# Altium schematic sheet DDR3.SchDoc
size A2
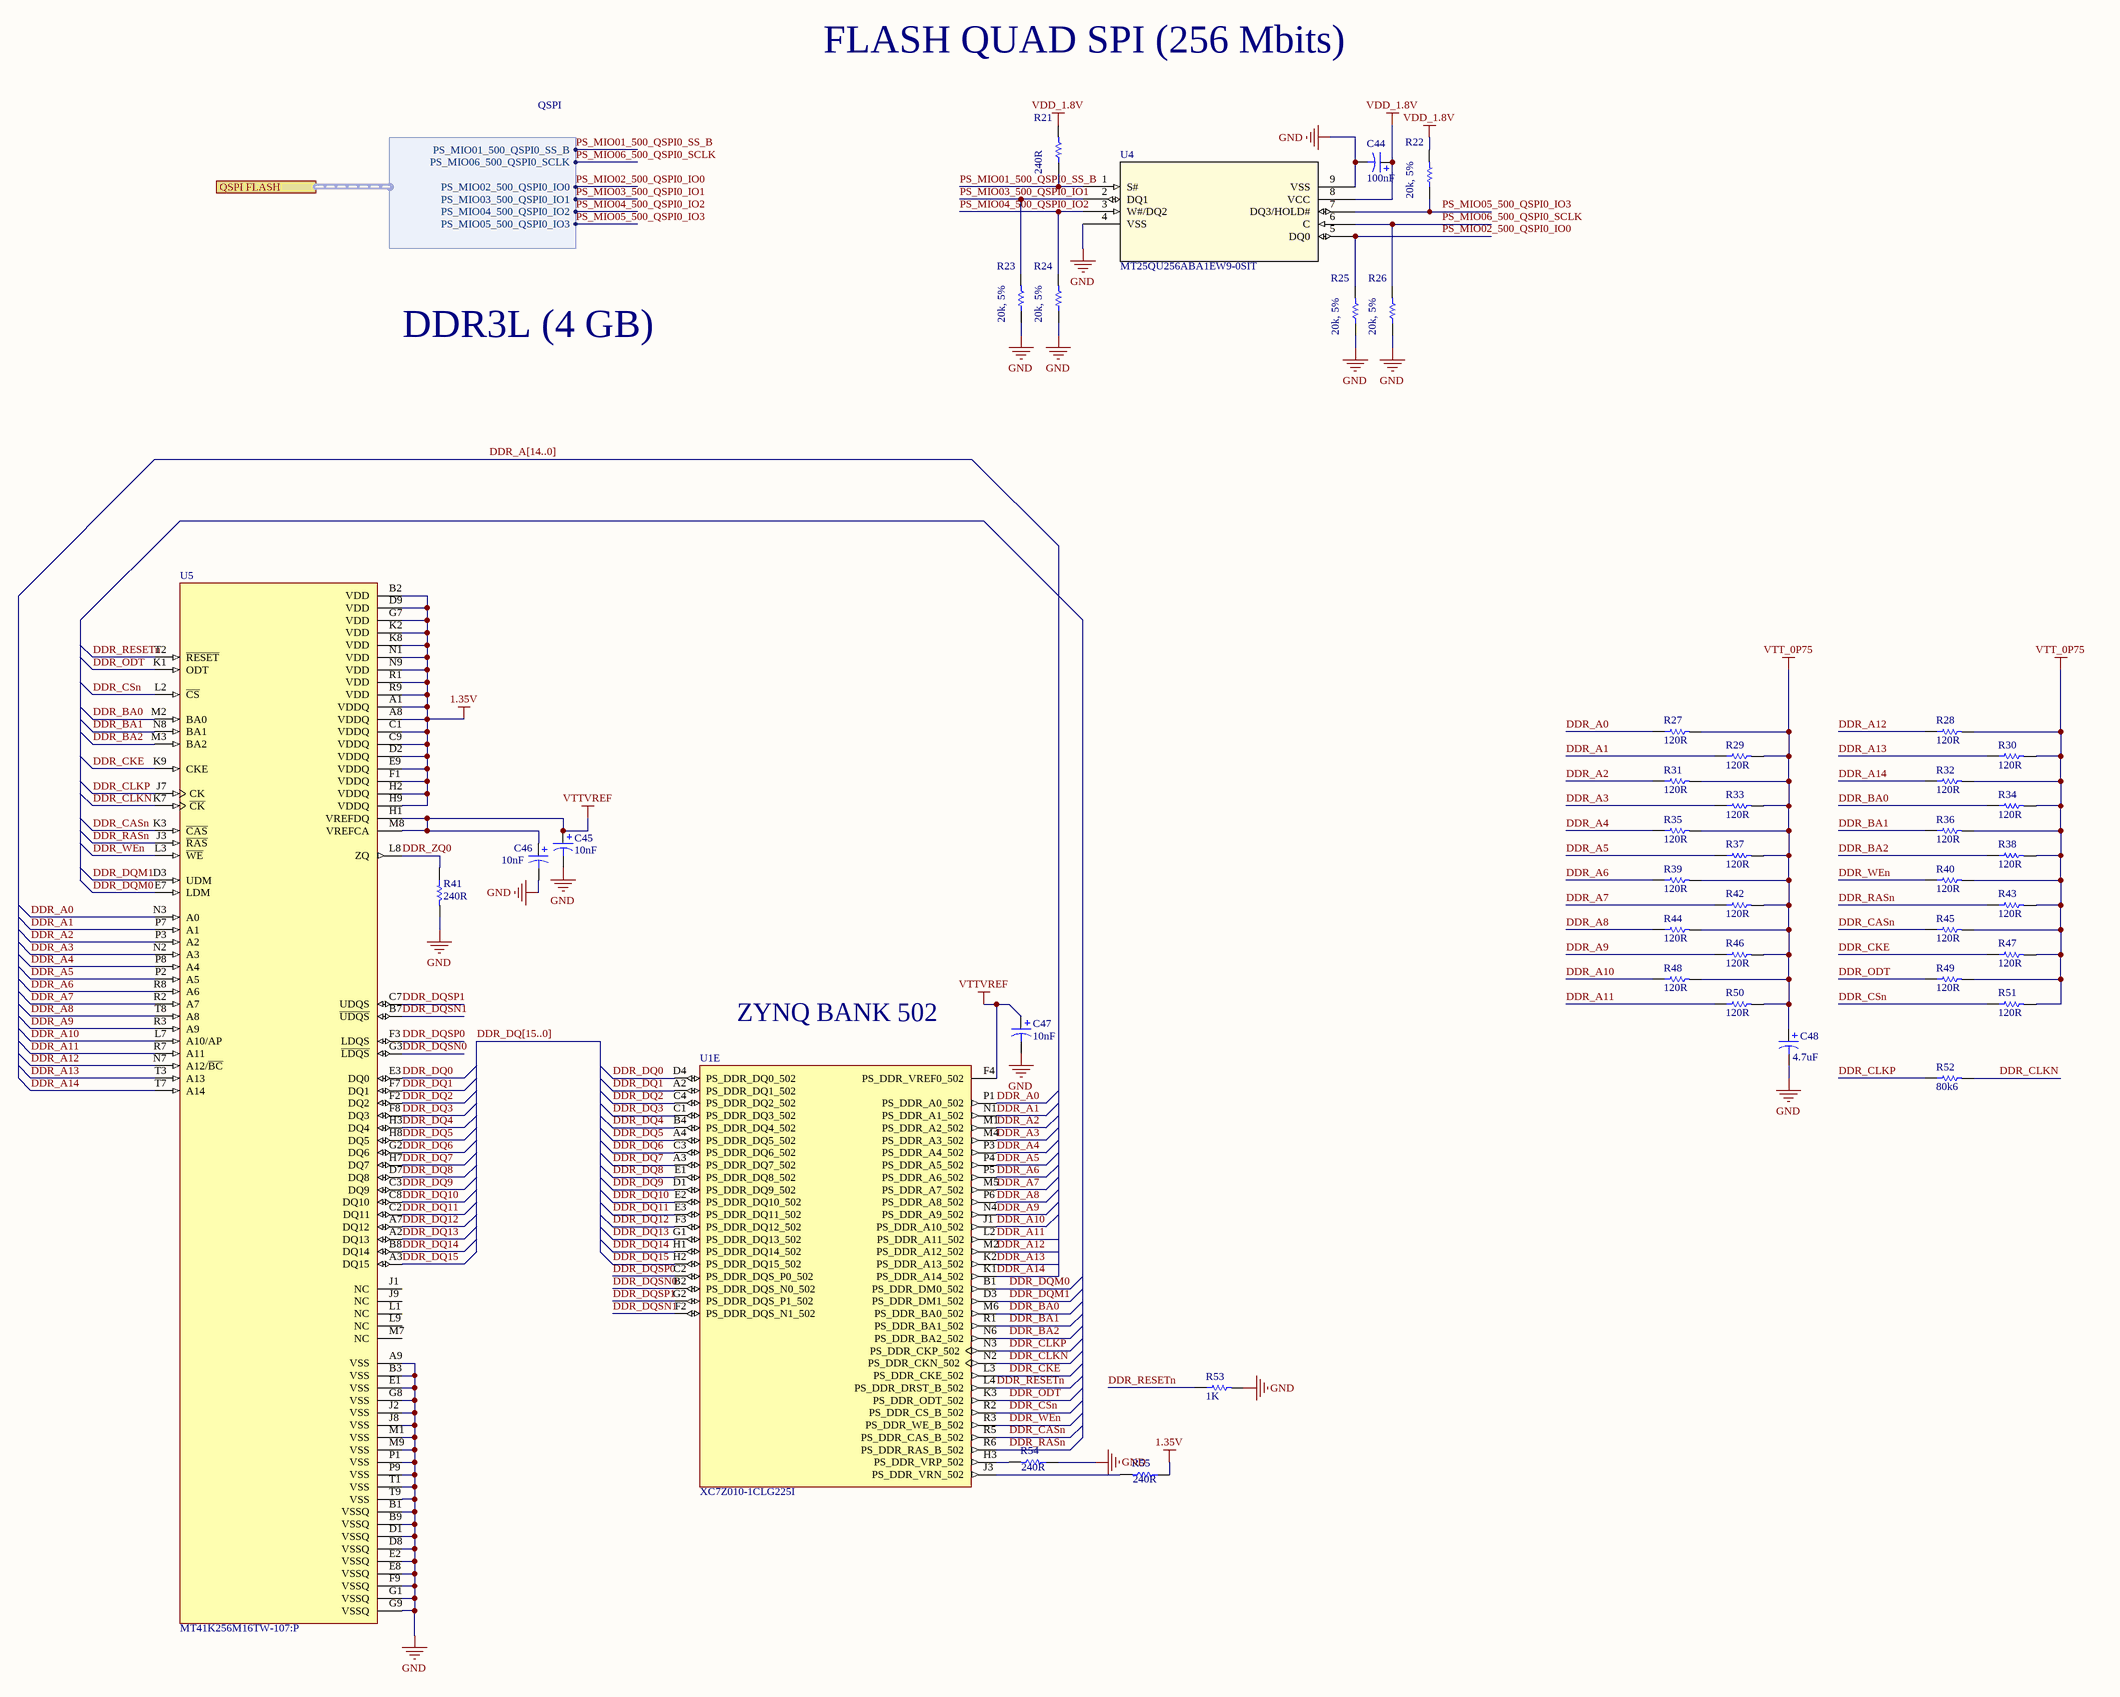
[diagram p0: DDR3.SchDoc]

## Parts
C44  value 100nF  [C0805]  (hidden comment: Cap Pol3)
C45  value 10nF  [C0805]  (hidden comment: Cap Pol3)
C46  value 10nF  [C0805]  (hidden comment: Cap Pol3)
C47  value 10nF  [C0805]  (hidden comment: Cap Pol3)
C48  value 4.7uF  [C0805]  (hidden comment: Cap Pol3)
R21  value 240R  [0603]  (hidden comment: Res1)
R22  value 20k, 5%  [0603]  (hidden comment: Res1)
R23  value 20k, 5%  [0603]  (hidden comment: Res1)
R24  value 20k, 5%  [0603]  (hidden comment: Res1)
R25  value 20k, 5%  [0603]  (hidden comment: Res1)
R26  value 20k, 5%  [0603]  (hidden comment: Res1)
R27  value 120R  [0603]  (hidden comment: Res1)
R28  value 120R  [0603]  (hidden comment: Res1)
R29  value 120R  [0603]  (hidden comment: Res1)
R30  value 120R  [0603]  (hidden comment: Res1)
R31  value 120R  [0603]  (hidden comment: Res1)
R32  value 120R  [0603]  (hidden comment: Res1)
R33  value 120R  [0603]  (hidden comment: Res1)
R34  value 120R  [0603]  (hidden comment: Res1)
R35  value 120R  [0603]  (hidden comment: Res1)
R36  value 120R  [0603]  (hidden comment: Res1)
R37  value 120R  [0603]  (hidden comment: Res1)
R38  value 120R  [0603]  (hidden comment: Res1)
R39  value 120R  [0603]  (hidden comment: Res1)
R40  value 120R  [0603]  (hidden comment: Res1)
R41  value 240R  [0603]  (hidden comment: Res1)
R42  value 120R  [0603]  (hidden comment: Res1)
R43  value 120R  [0603]  (hidden comment: Res1)
R44  value 120R  [0603]  (hidden comment: Res1)
R45  value 120R  [0603]  (hidden comment: Res1)
R46  value 120R  [0603]  (hidden comment: Res1)
R47  value 120R  [0603]  (hidden comment: Res1)
R48  value 120R  [0603]  (hidden comment: Res1)
R49  value 120R  [0603]  (hidden comment: Res1)
R50  value 120R  [0603]  (hidden comment: Res1)
R51  value 120R  [0603]  (hidden comment: Res1)
R52  value 80k6  [0603]  (hidden comment: Res1)
R53  value 1K  [0603]  (hidden comment: Res1)
R54  value 240R  [0603]  (hidden comment: Res1)
R55  value 240R  [0603]  (hidden comment: Res1)
U1  XC7Z010-1CLG225I  [BGA225C80P15X15_1300X1300X150N]  (part E of 6)
U4  MT25QU256ABA1EW9-0SIT  [W-PDFN-8MLP8_8X6_MRN]
U5  MT41K256M16TW-107:P  [BGA96C80P9X16_1400X800X120]

## Ports
QSPI FLASH (harness QSPI)

## Harnesses
QSPI: PS_MIO01_500_QSPI0_SS_B, PS_MIO06_500_QSPI0_SCLK, PS_MIO02_500_QSPI0_IO0, PS_MIO03_500_QSPI0_IO1, PS_MIO04_500_QSPI0_IO2, PS_MIO05_500_QSPI0_IO3

## Nets
1.35V: R55.1 U5.A1(VDDQ) U5.A8(VDDQ) U5.B2(VDD) U5.C1(VDDQ) U5.C9(VDDQ) U5.D2(VDDQ) U5.D9(VDD) U5.E9(VDDQ) U5.F1(VDDQ) U5.G7(VDD) U5.H2(VDDQ) U5.H9(VDDQ) U5.K2(VDD) U5.K8(VDD) U5.N1(VDD) U5.N9(VDD) U5.R1(VDD) U5.R9(VDD)
GND: C44.2 C45.2 C46.2 C47.2 C48.2 R23.1 R24.1 R25.1 R26.1 R41.2 R53.2 R54.1 U4.4(VSS) U4.9(VSS) U5.A9(VSS) U5.B1(VSSQ) U5.B3(VSS) U5.B9(VSSQ) U5.D1(VSSQ) U5.D8(VSSQ) U5.E1(VSS) U5.E2(VSSQ) U5.E8(VSSQ) U5.F9(VSSQ) U5.G1(VSSQ) U5.G8(VSS) U5.G9(VSSQ) U5.J2(VSS) U5.J8(VSS) U5.M1(VSS) U5.M9(VSS) U5.P1(VSS) U5.P9(VSS) U5.T1(VSS) U5.T9(VSS)
VDD_1.8V: C44.1 R21.2 R22.2 U4.8(VCC)
VTT_0P75: C48.1 R27.2 R28.2 R29.2 R30.2 R31.2 R32.2 R33.2 R34.2 R35.2 R36.2 R37.2 R38.2 R39.2 R40.2 R42.2 R43.2 R44.2 R45.2 R46.2 R47.2 R48.2 R49.2 R50.2 R51.2
VTTVREF: C45.1 C46.1 C47.1 U1.F4(PS_DDR_VREF0_502) U5.H1(VREFDQ) U5.M8(VREFCA)
DDR_A0: R27.1 U1.P1(PS_DDR_A0_502) U5.N3(A0)
DDR_A1: R29.1 U1.N1(PS_DDR_A1_502) U5.P7(A1)
DDR_A2: R31.1 U1.M1(PS_DDR_A2_502) U5.P3(A2)
DDR_A3: R33.1 U1.M4(PS_DDR_A3_502) U5.N2(A3)
DDR_A4: R35.1 U1.P3(PS_DDR_A4_502) U5.P8(A4)
DDR_A5: R37.1 U1.P4(PS_DDR_A5_502) U5.P2(A5)
DDR_A6: R39.1 U1.P5(PS_DDR_A6_502) U5.R8(A6)
DDR_A7: R42.1 U1.M5(PS_DDR_A7_502) U5.R2(A7)
DDR_A8: R44.1 U1.P6(PS_DDR_A8_502) U5.T8(A8)
DDR_A9: R46.1 U1.N4(PS_DDR_A9_502) U5.R3(A9)
DDR_A10: R48.1 U1.J1(PS_DDR_A10_502) U5.L7(A10/AP)
DDR_A11: R50.1 U1.L2(PS_DDR_A11_502) U5.R7(A11)
DDR_A12: R28.1 U1.M2(PS_DDR_A12_502) U5.N7(A12/~{BC})
DDR_A13: R30.1 U1.K2(PS_DDR_A13_502) U5.T3(A13)
DDR_A14: R32.1 U1.K1(PS_DDR_A14_502) U5.T7(A14)
DDR_BA0: R34.1 U1.M6(PS_DDR_BA0_502) U5.M2(BA0)
DDR_BA1: R36.1 U1.R1(PS_DDR_BA1_502) U5.N8(BA1)
DDR_BA2: R38.1 U1.N6(PS_DDR_BA2_502) U5.M3(BA2)
DDR_CASn: R45.1 U1.R5(PS_DDR_CAS_B_502) U5.K3(~{CAS})
DDR_CKE: R47.1 U1.L3(PS_DDR_CKE_502) U5.K9(CKE)
DDR_CLKN: R52.2 U1.N2(PS_DDR_CKN_502) U5.K7(~{CK})
DDR_CLKP: R52.1 U1.N3(PS_DDR_CKP_502) U5.J7(CK)
DDR_CSn: R51.1 U1.R2(PS_DDR_CS_B_502) U5.L2(~{CS})
DDR_DQ0: U1.D4(PS_DDR_DQ0_502) U5.E3(DQ0)
DDR_DQ1: U1.A2(PS_DDR_DQ1_502) U5.F7(DQ1)
DDR_DQ2: U1.C4(PS_DDR_DQ2_502) U5.F2(DQ2)
DDR_DQ3: U1.C1(PS_DDR_DQ3_502) U5.F8(DQ3)
DDR_DQ4: U1.B4(PS_DDR_DQ4_502) U5.H3(DQ4)
DDR_DQ5: U1.A4(PS_DDR_DQ5_502) U5.H8(DQ5)
DDR_DQ6: U1.C3(PS_DDR_DQ6_502) U5.G2(DQ6)
DDR_DQ7: U1.A3(PS_DDR_DQ7_502) U5.H7(DQ7)
DDR_DQ8: U1.E1(PS_DDR_DQ8_502) U5.D7(DQ8)
DDR_DQ9: U1.D1(PS_DDR_DQ9_502) U5.C3(DQ9)
DDR_DQ10: U1.E2(PS_DDR_DQ10_502) U5.C8(DQ10)
DDR_DQ11: U1.E3(PS_DDR_DQ11_502) U5.C2(DQ11)
DDR_DQ12: U1.F3(PS_DDR_DQ12_502) U5.A7(DQ12)
DDR_DQ13: U1.G1(PS_DDR_DQ13_502) U5.A2(DQ13)
DDR_DQ14: U1.H1(PS_DDR_DQ14_502) U5.B8(DQ14)
DDR_DQ15: U1.H2(PS_DDR_DQ15_502) U5.A3(DQ15)
DDR_DQM0: U1.B1(PS_DDR_DM0_502) U5.E7(LDM)
DDR_DQM1: U1.D3(PS_DDR_DM1_502) U5.D3(UDM)
DDR_DQSN0: U1.B2(PS_DDR_DQS_N0_502) U5.G3(~{LDQS})
DDR_DQSN1: U1.F2(PS_DDR_DQS_N1_502) U5.B7(~{UDQS})
DDR_DQSP0: U1.C2(PS_DDR_DQS_P0_502) U5.F3(LDQS)
DDR_DQSP1: U1.G2(PS_DDR_DQS_P1_502) U5.C7(UDQS)
DDR_ODT: R49.1 U1.K3(PS_DDR_ODT_502) U5.K1(ODT)
DDR_RASn: R43.1 U1.R6(PS_DDR_RAS_B_502) U5.J3(~{RAS})
DDR_RESETn: R53.1 U1.L4(PS_DDR_DRST_B_502) U5.T2(~{RESET})
DDR_WEn: R40.1 U1.R3(PS_DDR_WE_B_502) U5.L3(~{WE})
DDR_ZQ0: R41.1 U5.L8(ZQ)
PS_MIO01_500_QSPI0_SS_B: R21.1 U4.1(S#) ; port QSPI FLASH.PS_MIO01_500_QSPI0_SS_B
PS_MIO02_500_QSPI0_IO0: R25.2 U4.5(DQ0) ; port QSPI FLASH.PS_MIO02_500_QSPI0_IO0
PS_MIO03_500_QSPI0_IO1: R23.2 U4.2(DQ1) ; port QSPI FLASH.PS_MIO03_500_QSPI0_IO1
PS_MIO04_500_QSPI0_IO2: R24.2 U4.3(W#/DQ2) ; port QSPI FLASH.PS_MIO04_500_QSPI0_IO2
PS_MIO05_500_QSPI0_IO3: R22.1 U4.7(DQ3/HOLD#) ; port QSPI FLASH.PS_MIO05_500_QSPI0_IO3
PS_MIO06_500_QSPI0_SCLK: R26.2 U4.6(C) ; port QSPI FLASH.PS_MIO06_500_QSPI0_SCLK
NetR54_2: R54.2 U1.H3(PS_DDR_VRP_502)
NetR55_2: R55.2 U1.J3(PS_DDR_VRN_502)

Not connected (* = marked no-connect by the designer): U5 J1(NC) J9(NC) L1(NC) L9(NC) M7(NC)

## Buses and harness runs
bus DDR_A[14..0]
bus DDR_DQ[15..0]

## Notes on the sheet
- FLASH QUAD SPI (256 Mbits)
- DDR3L (4 GB)
- ZYNQ BANK 502

## Library data of the parts
C44-C48 = Cap Pol3: Polarized Capacitor (Surface Mount); Published: 8-Jun-2000; LatestRevisionDate: 29-May-2009; LatestRevisionNote: IPC-7351 Footprint Added.; PackageReference: C0805; Publisher: Altium Limited; PackageDescription: Chip Capacitor
R21-R55 = Res1_1: Resistor; Manufacturer: Generic Components; Class I: Passive; Published: 8-Jun-2000; Revision: July-2002: Re-released for DXP Platform.; Publisher: Altium Limited; Class II: Resistor; REF FARNELL 1206 SMD 510R: 4387065; REF FARNELL 1206 SMD 1K: 912475; REF FARNELL 1206 SMD 10K: 912591; REF FARNELL 0603 SMD: 612-595
U1 = XC7Z010-1CLG225I: Dual ARMÂ® CortexÂ®-A9 MPCoreâ„¢ with CoreSightâ„¢ System On Chip _SOC_ IC ZynqÂ®-7000 Artixâ„¢-7 FPGA, 28K Logic Cells 667MHz 225-CSPBGA _13x13_; MF: Xilinx Inc.; Price: None; Availability: Unavailable; SnapEDA_Link: https://www.snapeda.com/parts/XC7Z010-1CLG225I/Xilinx%20Inc./view-part/1219501/?ref=snap; Value: *; Package: CSPBGA-225 Xilinx; MP: XC7Z010-1CLG225I
U4 = MT25QU256ABA1EW9-0SIT: No Description Available; Mfr_Name: Micron; RefDes: RefDes; Type: Type
U5 = MT41K256M16TW-107:P: MF: {'manufacturer': u'Micron Technology Inc.'}; Package: None; Price: None; Value: *; MP: MT41K256M16TW-107:P; Availability: Unavailable